# EAGLE design Battery Discharge Monitoring Board rev3 (EAGLE 9.4.2)
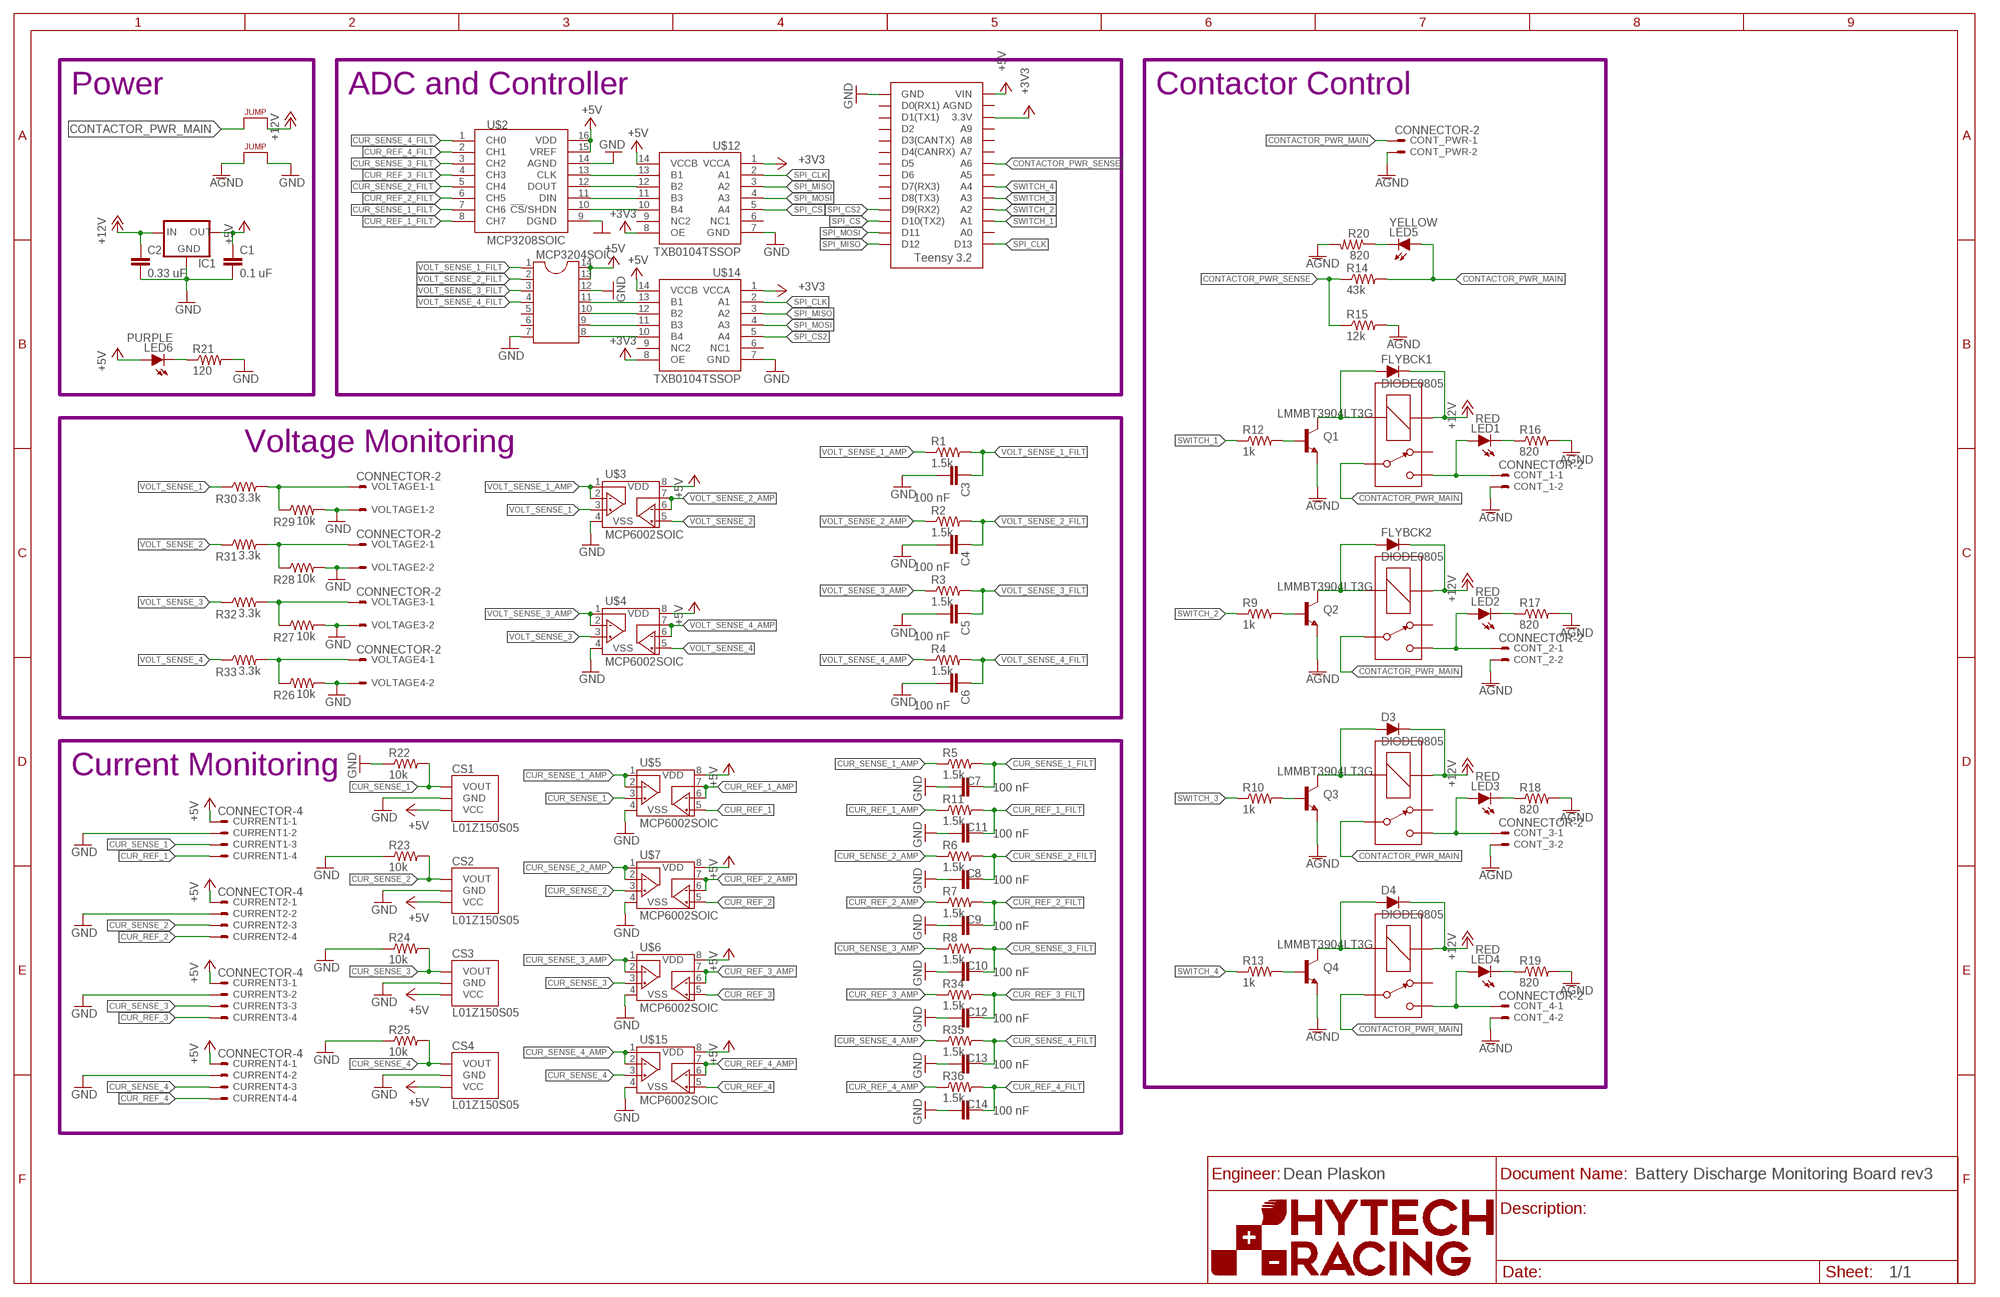
[diagram p0: schematic, sheet 1]
U$13 (FRAME_B_L): ORIENTATION: LANDSCAPE; SIZE: B

## Parts
C1  0.1 uF  CAP0805  [0805]
C2  0.33 uF  CAP0805  [0805]
C3  100 nF  CAP0805  [0805]
C4  100 nF  CAP0805  [0805]
C5  100 nF  CAP0805  [0805]
C6  100 nF  CAP0805  [0805]
C7  100 nF  CAP0805  [0805]
C8  100 nF  CAP0805  [0805]
C9  100 nF  CAP0805  [0805]
C10  100 nF  CAP0805  [0805]
C11  100 nF  CAP0805  [0805]
C12  100 nF  CAP0805  [0805]
C13  100 nF  CAP0805  [0805]
C14  100 nF  CAP0805  [0805]
CONT_1  CONNECTOR-2  [MINIFIT_5566-2]
CONT_2  CONNECTOR-2  [MINIFIT_5566-2]
CONT_3  CONNECTOR-2  [MINIFIT_5566-2]
CONT_4  CONNECTOR-2  [MINIFIT_5566-2]
CONT_PWR  CONNECTOR-2  [MINIFIT_5566-2]
CS1  L01Z150S05  [L01Z150S05]
CS2  L01Z150S05  [L01Z150S05]
CS3  L01Z150S05  [L01Z150S05]
CS4  L01Z150S05  [L01Z150S05]
CURRENT1  CONNECTOR-4  [MINIFIT_5566-4]
CURRENT2  CONNECTOR-4  [MINIFIT_5566-4]
CURRENT3  CONNECTOR-4  [MINIFIT_5566-4]
CURRENT4  CONNECTOR-4  [MINIFIT_5566-4]
D3  DIODE0805  [0805_D]
D4  DIODE0805  [0805_D]
FLYBCK1  DIODE0805  [0805_D]
FLYBCK2  DIODE0805  [0805_D]
IC1  5VREG_L7805SPACED  [TO-220-SPACED]
J1  JUMPER.1  [1X02]
J2  JUMPER  [0805]
LED1  RED  LED-0805  [LED-805]
LED2  RED  LED-0805  [LED-805]
LED3  RED  LED-0805  [LED-805]
LED4  RED  LED-0805  [LED-805]
LED5  YELLOW  LED-0805  [LED-805]
LED6  PURPLE  LED-0805  [LED-805]
MCP3204SOIC  MCP3204SOIC  [SOIC-14]
Q1  LMMBT3904LT3G  BJT_NPNSOT  [SOT23]
Q2  LMMBT3904LT3G  BJT_NPNSOT  [SOT23]
Q3  LMMBT3904LT3G  BJT_NPNSOT  [SOT23]
Q4  LMMBT3904LT3G  BJT_NPNSOT  [SOT23]
R1  1.5k  RESISTOR0805-RES  [0805]
R2  1.5k  RESISTOR0805-RES  [0805]
R3  1.5k  RESISTOR0805-RES  [0805]
R4  1.5k  RESISTOR0805-RES  [0805]
R5  1.5k  RESISTOR0805-RES  [0805]
R6  1.5k  RESISTOR0805-RES  [0805]
R7  1.5k  RESISTOR0805-RES  [0805]
R8  1.5k  RESISTOR0805-RES  [0805]
R9  1k  RESISTOR0805-RES  [0805]
R10  1k  RESISTOR0805-RES  [0805]
R11  1.5k  RESISTOR0805-RES  [0805]
R12  1k  RESISTOR0805-RES  [0805]
R13  1k  RESISTOR0805-RES  [0805]
R14  43k  RESISTOR0805-RES  [0805]
R15  12k  RESISTOR0805-RES  [0805]
R16  820  RESISTOR0805-RES  [0805]
R17  820  RESISTOR0805-RES  [0805]
R18  820  RESISTOR0805-RES  [0805]
R19  820  RESISTOR0805-RES  [0805]
R20  820  RESISTOR0805-RES  [0805]
R21  120  RESISTOR0805-RES  [0805]
R22  10k  RESISTOR0805-RES  [0805]
R23  10k  RESISTOR0805-RES  [0805]
R24  10k  RESISTOR0805-RES  [0805]
R25  10k  RESISTOR0805-RES  [0805]
R26  10k  RESISTOR0805-RES  [0805]
R27  10k  RESISTOR0805-RES  [0805]
R28  10k  RESISTOR0805-RES  [0805]
R29  10k  RESISTOR0805-RES  [0805]
R30  3.3k  RESISTOR0805-RES  [0805]
R31  3.3k  RESISTOR0805-RES  [0805]
R32  3.3k  RESISTOR0805-RES  [0805]
R33  3.3k  RESISTOR0805-RES  [0805]
R34  1.5k  RESISTOR0805-RES  [0805]
R35  1.5k  RESISTOR0805-RES  [0805]
R36  1.5k  RESISTOR0805-RES  [0805]
U$1  TEENSY_3.2_SIMPLE  [TEENSY_3.2_SIMPLE]
U$2  MCP3208SOIC  [SOIC-16]
U$3  MCP6002SOIC  [SOIC-08]
U$4  MCP6002SOIC  [SOIC-08]
U$5  MCP6002SOIC  [SOIC-08]
U$6  MCP6002SOIC  [SOIC-08]
U$7  MCP6002SOIC  [SOIC-08]
U$8  G5LE  [ZF112]
U$9  G5LE  [ZF112]
U$10  G5LE  [ZF112]
U$11  G5LE  [ZF112]
U$12  TXB0104TSSOP  [TSSOP-14]
U$14  TXB0104TSSOP  [TSSOP-14]
U$15  MCP6002SOIC  [SOIC-08]
VOLTAGE1  CONNECTOR-2  [MINIFIT_5566-2]
VOLTAGE2  CONNECTOR-2  [MINIFIT_5566-2]
VOLTAGE3  CONNECTOR-2  [MINIFIT_5566-2]
VOLTAGE4  CONNECTOR-2  [MINIFIT_5566-2]

## Nets
+3V3: U$1.3.3V U$12.1(VCCA) U$12.8(OE) U$14.1(VCCA) U$14.8(OE)
+5V: C1.1 CS1.3(VCC) CS2.3(VCC) CS3.3(VCC) CS4.3(VCC) CURRENT1.1 CURRENT2.1 CURRENT3.1 CURRENT4.1 IC1.3(OUT) LED6.A MCP3204SOIC.13(VREF) MCP3204SOIC.14(VDD) U$1.VIN U$2.15(VREF) U$2.16(VDD) U$3.8(VDD) U$4.8(VDD) U$5.8(VDD) U$6.8(VDD) U$7.8(VDD) U$12.14(VCCB) U$14.14(VCCB) U$15.8(VDD)
+12V: C2.1 D3.C D4.C FLYBCK1.C FLYBCK2.C IC1.1(IN) J1.2 U$8.1(COIL+) U$9.1(COIL+) U$10.1(COIL+) U$11.1(COIL+)
AGND: CONT_1.2 CONT_2.2 CONT_3.2 CONT_4.2 CONT_PWR.2 J2.1 Q1.2(EMITTER) Q2.2(EMITTER) Q3.2(EMITTER) Q4.2(EMITTER) R15.2 R16.2 R17.2 R18.2 R19.2 R20.2
CONTACTOR_PWR_1: CONT_1.1 LED1.A U$8.S
CONTACTOR_PWR_2: CONT_2.1 LED2.A U$9.S
CONTACTOR_PWR_3: CONT_3.1 LED3.A U$10.S
CONTACTOR_PWR_4: CONT_4.1 LED4.A U$11.S
CONTACTOR_PWR_MAIN: CONT_PWR.1 J1.1 LED5.A R14.2 U$8.P U$9.P U$10.P U$11.P
CONTACTOR_PWR_SENSE: R14.1 R15.1 U$1.A6
CUR_REF_1: CURRENT1.4 U$5.5(VINB+)
CUR_REF_1_AMP: R11.1 U$5.6(VINB-) U$5.7(VOUTB)
CUR_REF_1_FILT: C11.1 R11.2 U$2.8(CH7)
CUR_REF_2: CURRENT2.4 U$7.5(VINB+)
CUR_REF_2_AMP: R7.1 U$7.6(VINB-) U$7.7(VOUTB)
CUR_REF_2_FILT: C9.1 R7.2 U$2.6(CH5)
CUR_REF_3: CURRENT3.4 U$6.5(VINB+)
CUR_REF_3_AMP: R34.1 U$6.6(VINB-) U$6.7(VOUTB)
CUR_REF_3_FILT: C12.1 R34.2 U$2.4(CH3)
CUR_REF_4: CURRENT4.4 U$15.5(VINB+)
CUR_REF_4_AMP: R36.1 U$15.6(VINB-) U$15.7(VOUTB)
CUR_REF_4_FILT: C14.1 R36.2 U$2.2(CH1)
CUR_SENSE_1: CS1.1(VOUT) CURRENT1.3 R22.2 U$5.3(VINA+)
CUR_SENSE_1_AMP: R5.1 U$5.1(VOUTA) U$5.2(VINA-)
CUR_SENSE_1_FILT: C7.1 R5.2 U$2.7(CH6)
CUR_SENSE_2: CS2.1(VOUT) CURRENT2.3 R23.2 U$7.3(VINA+)
CUR_SENSE_2_AMP: R6.1 U$7.1(VOUTA) U$7.2(VINA-)
CUR_SENSE_2_FILT: C8.1 R6.2 U$2.5(CH4)
CUR_SENSE_3: CS3.1(VOUT) CURRENT3.3 R24.2 U$6.3(VINA+)
CUR_SENSE_3_AMP: R8.1 U$6.1(VOUTA) U$6.2(VINA-)
CUR_SENSE_3_FILT: C10.1 R8.2 U$2.3(CH2)
CUR_SENSE_4: CS4.1(VOUT) CURRENT4.3 R25.2 U$15.3(VINA+)
CUR_SENSE_4_AMP: R35.1 U$15.1(VOUTA) U$15.2(VINA-)
CUR_SENSE_4_FILT: C13.1 R35.2 U$2.1(CH0)
GND: C1.2 C2.2 C3.2 C4.2 C5.2 C6.2 C7.2 C8.2 C9.2 C10.2 C11.2 C12.2 C13.2 C14.2 CS1.2(GND) CS2.2(GND) CS3.2(GND) CS4.2(GND) CURRENT1.2 CURRENT2.2 CURRENT3.2 CURRENT4.2 IC1.2(GND) J2.2 MCP3204SOIC.7(DGND) MCP3204SOIC.12(AGND) R21.2 R22.1 R23.1 R24.1 R25.1 R26.2 R27.2 R28.2 R29.2 U$1.GND U$2.9(DGND) U$2.14(AGND) U$3.4(VSS) U$4.4(VSS) U$5.4(VSS) U$6.4(VSS) U$7.4(VSS) U$12.7(GND) U$14.7(GND) U$15.4(VSS) VOLTAGE1.2 VOLTAGE2.2 VOLTAGE3.2 VOLTAGE4.2
N27: R26.1 R33.2 VOLTAGE4.1
N$1: MCP3204SOIC.11(CLK) U$14.13(B1)
N$2: MCP3204SOIC.10(DOUT) U$14.12(B2)
N$3: Q2.1(BASE) R9.2
N$4: Q1.1(BASE) R12.2
N$5: FLYBCK1.A Q1.3(COLLECTOR) U$8.2(COIL-)
N$6: FLYBCK2.A Q2.3(COLLECTOR) U$9.2(COIL-)
N$7: Q3.1(BASE) R10.2
N$8: D3.A Q3.3(COLLECTOR) U$10.2(COIL-)
N$9: Q4.1(BASE) R13.2
N$10: D4.A Q4.3(COLLECTOR) U$11.2(COIL-)
N$11: LED2.C R17.1
N$12: LED1.C R16.1
N$13: LED3.C R18.1
N$14: LED4.C R19.1
N$15: LED5.C R20.1
N$16: LED6.C R21.1
N$17: U$2.13(CLK) U$12.13(B1)
N$18: U$2.12(DOUT) U$12.12(B2)
N$19: U$2.11(DIN) U$12.11(B3)
N$20: U$2.10(!CS!/SHDN) U$12.10(B4)
N$22: R29.1 R30.2 VOLTAGE1.1
N$23: R28.1 R31.2 VOLTAGE2.1
N$24: R27.1 R32.2 VOLTAGE3.1
N$25: MCP3204SOIC.9(DIN) U$14.11(B3)
N$26: MCP3204SOIC.8(/CS) U$14.10(B4)
SPI_CLK: U$1.D13 U$12.2(A1) U$14.2(A1)
SPI_CS: U$1.D10(TX2) U$12.5(A4)
SPI_CS2: U$1.D9(RX2) U$14.5(A4)
SPI_MISO: U$1.D12 U$12.3(A2) U$14.3(A2)
SPI_MOSI: U$1.D11 U$12.4(A3) U$14.4(A3)
SWITCH_1: R12.1 U$1.A1
SWITCH_2: R9.1 U$1.A2
SWITCH_3: R10.1 U$1.A3
SWITCH_4: R13.1 U$1.A4
VOLT_SENSE_1: R30.1 U$3.3(VINA+)
VOLT_SENSE_1_AMP: R1.1 U$3.1(VOUTA) U$3.2(VINA-)
VOLT_SENSE_1_FILT: C3.1 MCP3204SOIC.1(CH0) R1.2
VOLT_SENSE_2: R31.1 U$3.5(VINB+)
VOLT_SENSE_2_AMP: R2.1 U$3.6(VINB-) U$3.7(VOUTB)
VOLT_SENSE_2_FILT: C4.1 MCP3204SOIC.2(CH1) R2.2
VOLT_SENSE_3: R32.1 U$4.3(VINA+)
VOLT_SENSE_3_AMP: R3.1 U$4.1(VOUTA) U$4.2(VINA-)
VOLT_SENSE_3_FILT: C5.1 MCP3204SOIC.3(CH2) R3.2
VOLT_SENSE_4: R33.1 U$4.5(VINB+)
VOLT_SENSE_4_AMP: R4.1 U$4.6(VINB-) U$4.7(VOUTB)
VOLT_SENSE_4_FILT: C6.1 MCP3204SOIC.4(CH3) R4.2
Unconnected: MCP3204SOIC.5(NC0) MCP3204SOIC.6(NC1) U$1.A0 U$1.A5 U$1.A7 U$1.A8 U$1.A9 U$1.AGND U$1.D0(RX1) U$1.D1(TX1) U$1.D2 U$1.D3(CANTX) U$1.D4(CANRX) U$1.D5 U$1.D6 U$1.D7(RX3) U$1.D8(TX3) U$8.O U$9.O U$10.O U$11.O U$12.6(NC1) U$12.9(NC2) U$14.6(NC1) U$14.9(NC2)

## Notes on the sheet
- Power | ADC and Controller | Contactor Control
- Voltage Monitoring
- Current Monitoring
- Dean Plaskon

## Library data of the parts
C1-C14 = HyTechDevices:CAP: Capacitor Standard 0603 ceramic capacitor, and 0.1" leaded capacitor.
CONT_1-CONT_4 CONT_PWR VOLTAGE1-VOLTAGE4 = HyTechDevices:CONNECTOR-2: Mini-Fit Junior connector 2 pole Source: http://www.molex.com; OC_FARNELL: 1822072; OC_NEWARK: unknown
CS1-CS4 = HyTechDevices:L01Z150S05: Tamura Hall Effect Current Sensors L01Z***S05 Series Refer to datasheet <http://www.tamuracorp.com/clientuploads/pdfs/engineeringdocs/L01ZXXXS05.pdf>
CURRENT1-CURRENT4 = HyTechDevices:CONNECTOR-4: Mini-Fit Junior connector 4 pole Source: http://www.molex.com; OC_FARNELL: unknown; OC_NEWARK: unknown
D3 D4 FLYBCK1 FLYBCK2 = HyTechDevices:DIODE: DIODE general purpose rectifier
IC1 = HyTechDevices:5VREG_L7805: Voltage Regulator Switching 5v regulator Datasheet <http://power.murata.com/data/power/oki-78sr.pdf> Standard 7805 5V regulator. IGO (Input Ground Output). Spark Fun Electronics SKU : COM-00107 Datasheet <http://www.mouser.com/ds/2/308/MC7800-D-94905.pdf>
J1 J2 = HyTechDevices:JUMPER: Jumper for changing operation of a device
LED1-LED6 = HyTechDevices:LED: Light Emitting Diode (LED) Source: Dangerous Prototypes Eagle Library <https://github.com/DangerousPrototypes/Eagle_Part_Library>
MCP3204SOIC = MCP3204SOIC:MCP3204SOIC: 4 Channel 12-Bit ADC
Q1-Q4 = HyTechDevices:BJT_NPN: Generic NPN BJT MMBT2222A - TRANS-08049 (SOT-23, 1A 40V) MPSA42 - TRANS-09116 (SOT-23, 500mA 300V) MMBT5088LT1G - TRANS-11160 (SOT-23, 50 mA 30V) BC547 - COM-08928 <http://www.sparkfun.com/products/8928> (TO-92 45V 100mA) (1.Collector 2.Base 3.Emitter) 2N3904 - COM-00521 <http://www.sparkfun.com/products/521> (TO-92 40V 200mA) (1.Emitter 2.Base 3.Collector) P2N2222A - COM-12852 <http://www.sparkfun.com/products/12852> (TO-92 40V 600mA) (1.Collector 2.Base 3.Emitter) Source: Sparkfun <https://github.com/sparkfun/SparkFun-Eagle-Libraries>
R1-R36 = HyTechDevices:RESISTOR: Resistor Basic schematic elements and footprints for 0603, 1206, and PTH resistors.
U$1 = HyTechDevices:TEENSY_3.2_SIMPLE: Simple version of the Teensy 3.2 board that only uses the 2 main rows of pins, not the inner pins or the pins opposite the usb port.
U$2 = HyTechDevices:MCP3208: Analog to Digital Converter
U$3-U$7 U$15 = HyTechDevices:MCP6002: Microchip MCP6002 Dual Channel Op Amp
U$8-U$11 = HyTechDevices:G5LE: Omron G5LE SPST Relay 5 VDC, 12VDC, 24VDC models Coil voltage: 75% - 170% of nominal voltage Datasheet <https://www.omron.com/ecb/products/pdf/en-g5le.pdf>
U$12 U$14 = HyTechDevices:TXB0104: Texas Instruments TXB0104 4-channel low voltage to high voltage Logic Level Shifter. Minimum input voltage level 1.8V. Maximum output voltage level 5.5V.

## Board
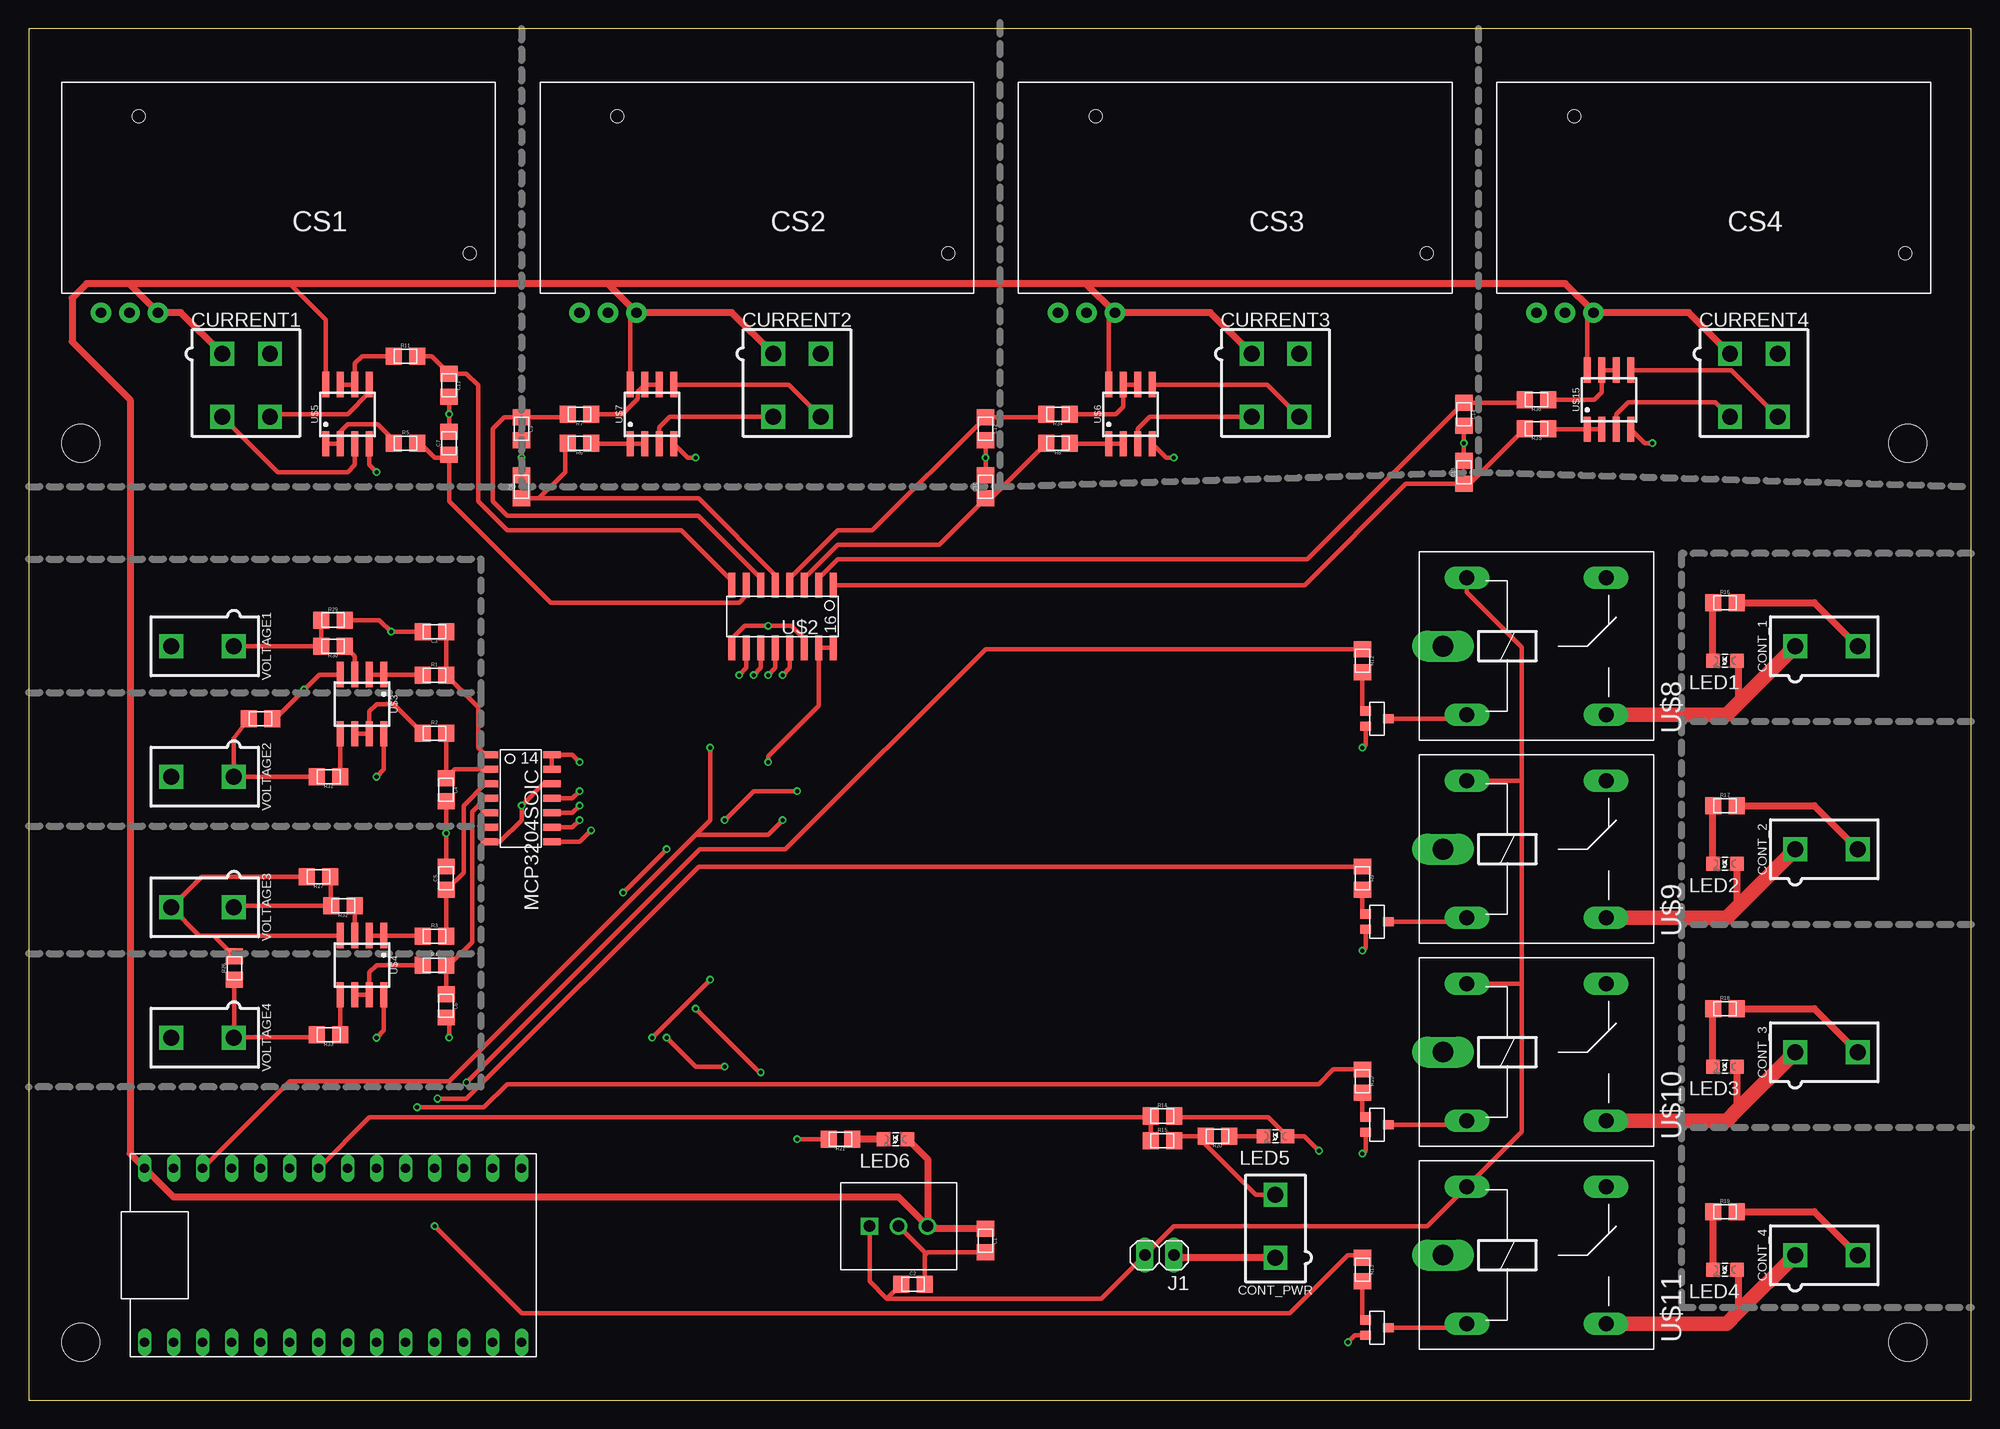
[diagram p1: board, top side]
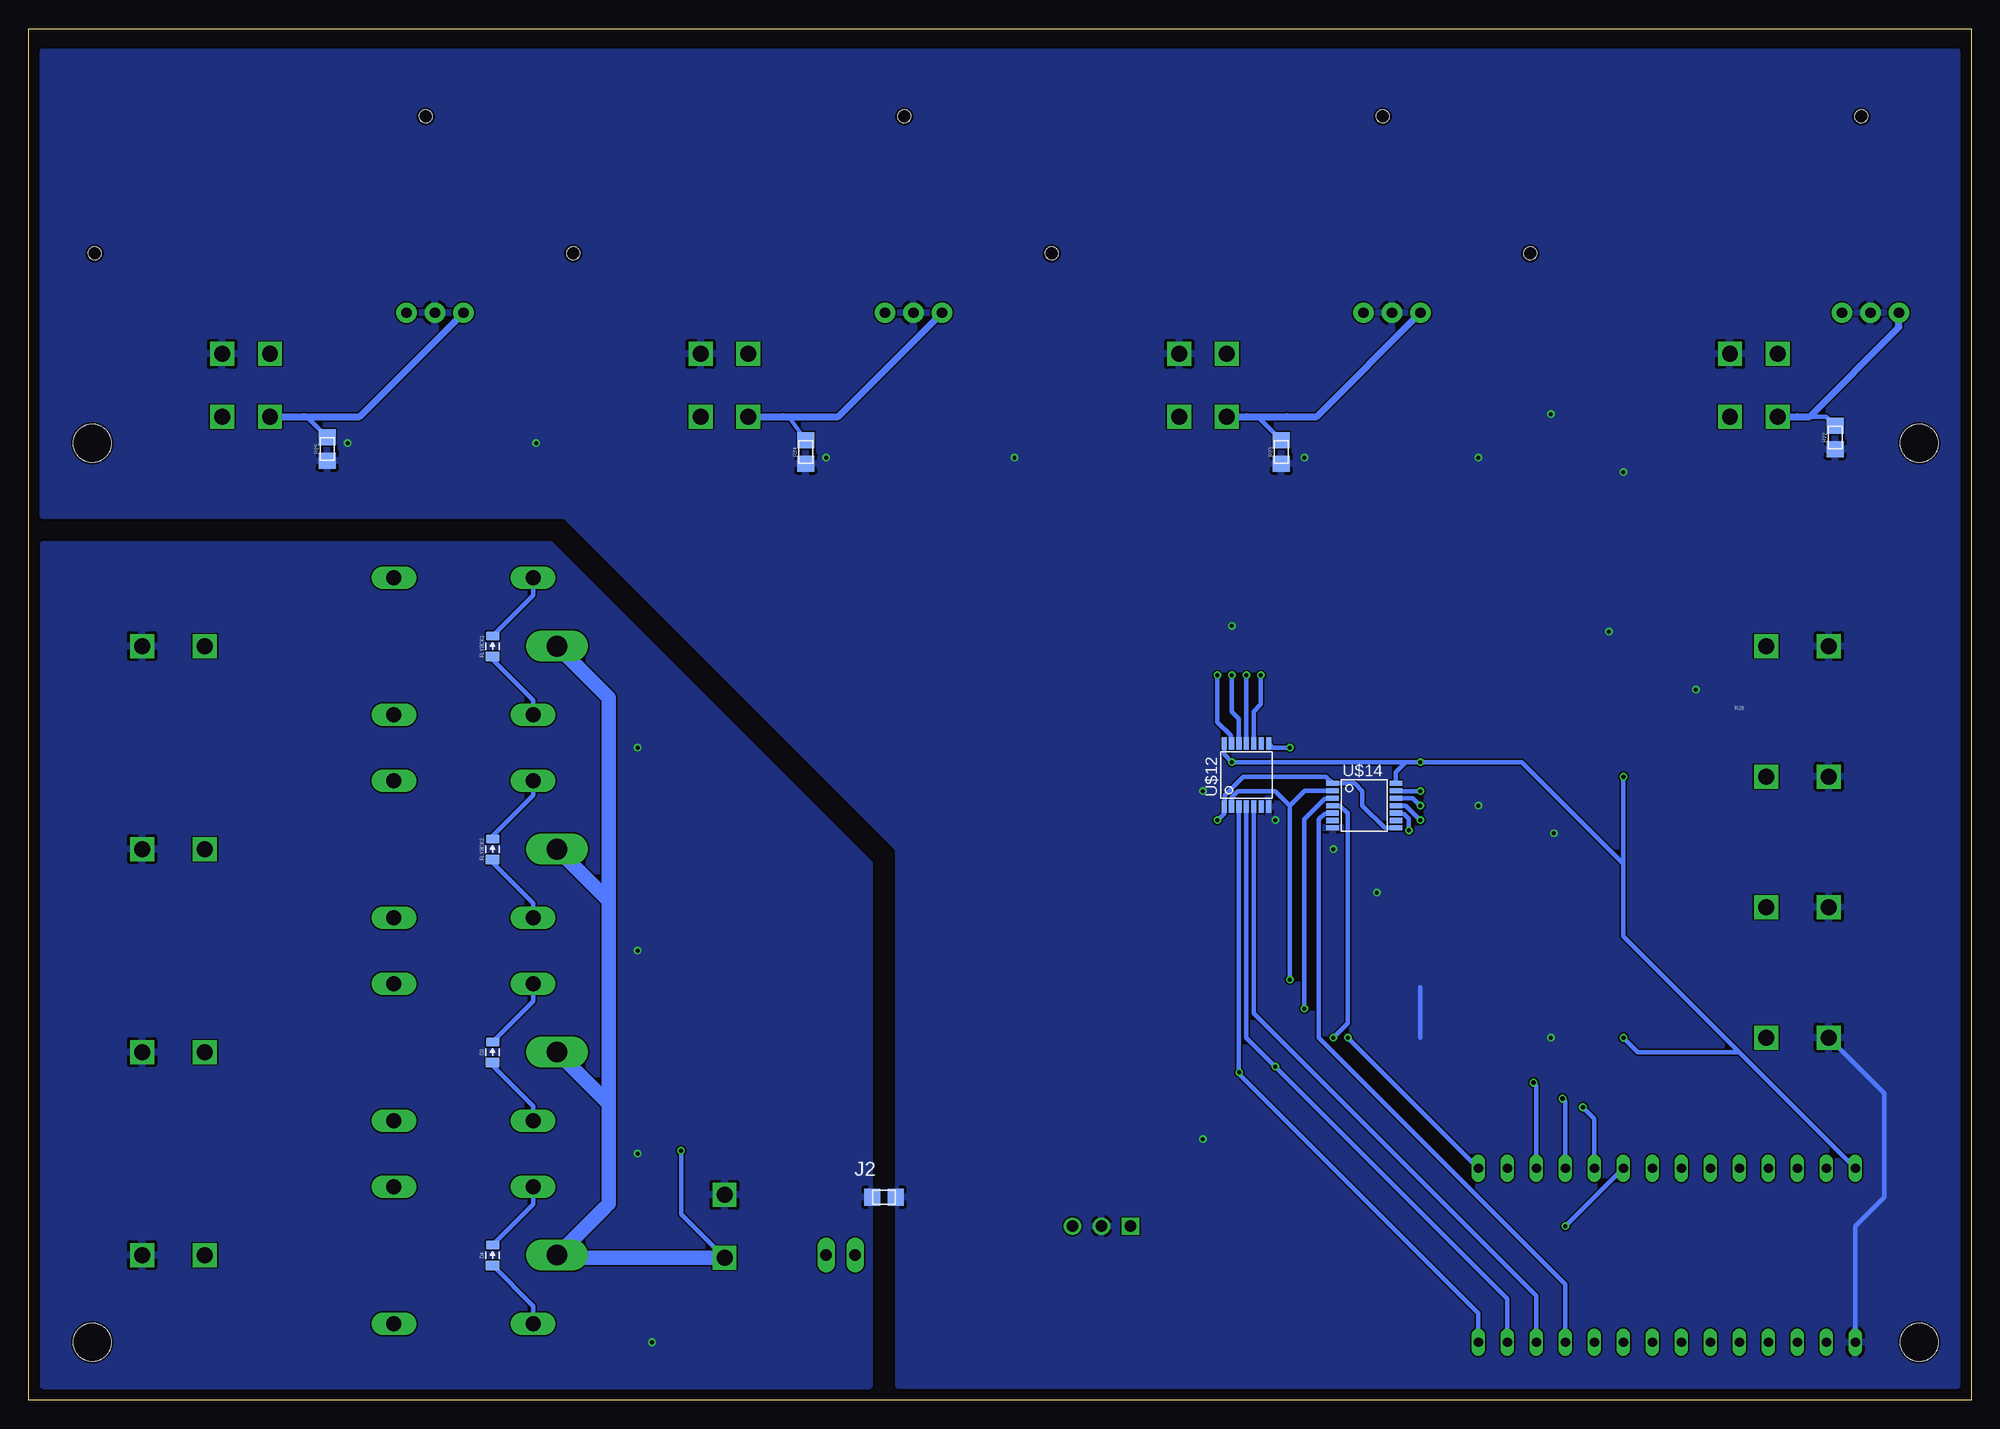
[diagram p2: board, bottom side, seen from below]

Size 170.18 x 120.14 mm. Coordinates in mm from the lower left corner, seen from the top.
Outline: 0,0 170.18,0 170.18,120.14 0,120.14 0,0
Copper layers (1*16): Top 0.035mm / dielectric 1.53mm / Bottom 0.035mm
Design rules "JLCPCB (2 Layer)": minimum track width 5mil, minimum drill 0.3mm, track to track 5mil, track to pad 5mil, pad to pad 5mil, via to via 20mil, smd to smd 5mil, copper to edge 0.2mm, drill to drill 21mil, minimum pad ring 6mil, minimum via ring 6mil, stop-mask expansion 6mil, vias tented up to drill 30mil, thermal gap 10mil
Holes 3.3 mm at 4.57,5.08 164.59,5.08 4.57,83.82 164.59,83.82

### Footprints (pad centres in the part's own frame; a part is rotated, then mirrored left to right if it is on the bottom)
0805 = smd 1.4 x 1.5: 1 -1.025,0; 2 1.025,0
MINIFIT_5566-2 = drill 1.4 square: 1 0,-2.75; 2 0,2.75
L01Z150S05 = drill 0.9 pad 1.778: 1 0,0; 2 -2.5,0; 3 -5,0 | hole 1.15: -3.3,-17.2; -32.3,-5.2
MINIFIT_5566-4 = drill 1.4 square: 1 2.1,-2.75; 2 -2.1,-2.75; 3 2.1,2.75; 4 -2.1,2.75
0805_D = smd 0.8 x 1.2: A -0.9,0; C 0.9,0
TO-220-SPACED = drill 1 square: 1 -2.54,0 | drill 1: 2 0,0; 3 2.54,0
1X02 = drill 1.016 long: 1 -1.27,0; 2 1.27,0
LED-805 = smd 1.2 x 1.2: A 0,-1.05; C 0,1.05
SOIC-14 = smd 0.61 x 1.524: 1 -4.445,-2.794; 2 -3.175,-2.794; 3 -1.905,-2.794; 4 -0.635,-2.794; 5 0.635,-2.794; 6 1.905,-2.794; 7 3.175,-2.794; 8 3.175,2.667; 9 1.905,2.667; 10 0.635,2.667; 11 -0.635,2.667; 12 -1.905,2.667; 13 -3.175,2.667; 14 -4.445,2.667
SOT23 = smd 0.8 x 0.9: 1 -0.675,-1; 2 0.675,-1; 3 0,1
TEENSY_3.2_SIMPLE = drill 0.8 long: 3.3V 16.51,29.21; A0 16.51,3.81; A1 16.51,6.35; A2 16.51,8.89; A3 16.51,11.43; A4 16.51,13.97; A5 16.51,16.51; A6 16.51,19.05; A7 16.51,21.59; A8 16.51,24.13; A9 16.51,26.67; AGND 16.51,31.75; D0(RX1) 1.27,31.75; D1(TX1) 1.27,29.21; D2 1.27,26.67; D3(CANTX) 1.27,24.13; D4(CANRX) 1.27,21.59; D5 1.27,19.05; D6 1.27,16.51; D7(RX3) 1.27,13.97; D8(TX3) 1.27,11.43; D9(RX2) 1.27,8.89; D10(TX2) 1.27,6.35; D11 1.27,3.81; D12 1.27,1.27; D13 16.51,1.27; GND 1.27,34.29; VIN 16.51,34.29
SOIC-16 = smd 0.6 x 2.2: 1 -4.445,-2.794; 2 -3.175,-2.794; 3 -1.905,-2.794; 4 -0.635,-2.794; 5 0.635,-2.794; 6 1.905,-2.794; 7 3.175,-2.794; 8 4.445,-2.794; 9 4.445,2.667; 10 3.175,2.667; 11 1.905,2.667; 12 0.635,2.667; 13 -0.635,2.667; 14 -1.905,2.667; 15 -3.175,2.667; 16 -4.445,2.667
SOIC-08 = smd 0.6 x 2.2: 1 -1.905,-2.6; 2 -0.635,-2.6; 3 0.635,-2.6; 4 1.905,-2.6; 5 1.905,2.6; 6 0.635,2.6; 7 -0.635,2.6; 8 -1.905,2.6
ZF112 = drill 1.321 long: 1 4.064,14.884; 2 4.064,2.896; O 16.256,14.884; S 16.256,2.896 | drill 1.803 long: P 1.956,8.89
TSSOP-14 = smd 0.45 x 1.1: 1 -1.958,-2.618; 2 -1.308,-2.618; 3 -0.657,-2.618; 4 -0.007,-2.618; 5 0.642,-2.618; 6 1.292,-2.618; 7 1.942,-2.618; 8 1.942,2.918; 9 1.292,2.918; 10 0.642,2.918; 11 -0.007,2.918; 12 -0.657,2.918; 13 -1.308,2.918; 14 -1.958,2.918

### Placement (x,y rotation side)
C1  83.82,13.97 270 top
C2  77.47,10.16 0 top
C3  35.56,67.31 180 top
C4  36.58,53.47 270 top
C5  36.58,45.72 90 top
C6  36.58,34.54 270 top
C7  36.83,83.82 90 top
C8  43.18,80.01 90 top
C9  43.18,85.09 270 top
C10  83.82,80.01 90 top
C11  36.83,88.9 270 top
C12  83.82,85.09 270 top
C13  125.73,81.28 90 top
C14  125.73,86.36 270 top
CONT_1  157.48,66.04 270 top
CONT_2  157.48,48.26 270 top
CONT_3  157.48,30.48 270 top
CONT_4  157.48,12.7 270 top
CONT_PWR  109.22,15.24 0 top
CS1  6.35,95.25 180 top
CS2  48.26,95.25 180 top
CS3  90.17,95.25 180 top
CS4  132.08,95.25 180 top
CURRENT1  19.05,88.9 180 top
CURRENT2  67.31,88.9 180 top
CURRENT3  109.22,88.9 180 top
CURRENT4  151.13,88.9 180 top
D3  129.54,30.48 90 bottom
D4  129.54,12.7 90 bottom
FLYBCK1  129.54,66.04 90 bottom
FLYBCK2  129.54,48.26 90 bottom
IC1  76.2,15.24 0 top
J1  99.06,12.7 180 top
J2  95.25,17.78 0 bottom
LED1  148.59,64.77 90 top
LED2  148.59,46.99 90 top
LED3  148.59,29.21 90 top
LED4  148.59,11.43 90 top
LED5  109.22,23.11 90 top
LED6  75.95,22.86 90 top
MCP3204SOIC  43.18,52.07 270 top
Q1  118.11,59.69 270 top
Q2  118.11,41.91 270 top
Q3  118.11,24.13 270 top
Q4  118.11,6.35 270 top
R1  35.56,63.5 0 top
R2  35.56,58.42 0 top
R3  35.56,40.64 0 top
R4  35.56,38.1 0 top
R5  33.02,83.82 0 top
R6  48.26,83.82 180 top
R7  48.26,86.36 180 top
R8  90.17,83.82 180 top
R9  116.84,45.72 270 top
R10  116.84,27.94 270 top
R11  33.02,91.44 0 top
R12  116.84,64.77 270 top
R13  116.84,11.43 270 top
R14  99.31,24.89 0 top
R15  99.31,22.73 0 top
R16  148.59,69.85 0 top
R17  148.59,52.07 0 top
R18  148.59,34.29 0 top
R19  148.59,16.51 0 top
R20  104.14,23.11 180 top
R21  71.12,22.86 180 top
R22  11.94,84.33 90 bottom
R23  60.45,83.06 90 bottom
R24  102.11,83.06 90 bottom
R25  144.02,83.31 90 bottom
R26  18.03,37.85 90 top
R27  25.4,45.85 180 top
R28  20.32,59.69 0 top
R29  26.67,68.33 0 top
R30  26.67,66.04 180 top
R31  26.29,54.61 180 top
R32  27.56,43.31 180 top
R33  26.29,32 180 top
R34  90.17,86.36 180 top
R35  132.08,85.09 180 top
R36  132.08,87.63 180 top
U$1  44.45,3.81 90 top
U$2  66.04,68.58 180 top
U$3  29.21,60.96 180 top
U$4  29.21,38.1 180 top
U$5  27.94,86.36 0 top
U$6  96.52,86.36 0 top
U$7  54.61,86.36 0 top
U$8  121.92,57.15 0 top
U$9  121.92,39.37 0 top
U$10  121.92,21.59 0 top
U$11  121.92,3.81 0 top
U$12  63.5,54.61 0 bottom
U$14  53.34,52.07 270 bottom
U$15  138.43,87.63 0 top
VOLTAGE1  15.24,66.04 90 top
VOLTAGE2  15.24,54.61 90 top
VOLTAGE3  15.24,43.18 90 top
VOLTAGE4  15.24,31.75 90 top

### Tracks (layer width: path | path; a pad name or v marks a point on that pad's centre or on a via)
+3V3  (via drill 0.35)
  Top 0.406: U$1.3.3V 22.86,27.94 36.83,27.94 58.42,49.53 | v66.04,50.8 64.77,49.53 58.42,49.53 | v59.69,57.15 59.69,53.34 59.69,50.8 58.42,49.53
  Bottom 0.406: U$12.8 61.18,57.15 v59.69,57.15 | v66.04,50.8 65.46,51.38 U$12.1 65.39,52.06 65.39,53 63.78,54.61 56.54,54.61 U$14.1 54.03,54.03 53.34,53.34 53.34,52.07 51.4,50.13 U$14.8
+5V  (via drill 0.35, 0.38)
  Top 0.406: U$3.8 31.11,55.24 v30.48,54.61 | U$4.8 31.11,32.38 v30.48,31.75 | U$15.8 136.53,94.69 CS4.3 | U$6.8 94.61,94.69 CS3.3 | U$7.8 52.7,94.69 CS2.3 | U$5.8 26.04,94.61 22.86,97.79 | v64.77,55.88 64.77,56.39 69.22,60.83 U$2.15 U$2.16 | MCP3204SOIC.13 MCP3204SOIC.14 47.62,56.52 v48.26,55.88
  Top 0.61: CURRENT1.1 13.35,95.25 CS1.3 8.81,97.79 | CURRENT2.1 61.61,95.25 CS2.3 50.72,97.79 | CURRENT3.1 103.52,95.25 CS3.3 92.71,97.71 92.71,97.79 | CURRENT4.1 145.43,95.25 CS4.3 137.08,95.33 134.62,97.79 92.71,97.79 | 92.71,97.79 83.82,97.79 50.72,97.79 | 50.72,97.79 41.91,97.79 22.86,97.79 8.81,97.79 | 8.81,97.79 5.08,97.79 3.81,96.52 3.81,92.71 8.89,87.63 8.89,21.59 U$1.VIN 12.7,17.78 76.2,17.78 IC1.3 | LED6.A 78.74,21.12 IC1.3 | C1.1 78.98,14.99 IC1.3
  Bottom 0.406: U$1.VIN 20.32,30.48 | 20.32,30.48 30.48,40.64 30.48,46.99 | v30.48,31.75 29.21,30.48 20.32,30.48 | 30.48,46.99 v30.48,54.61 | 30.48,46.99 39.37,55.88 v48.26,55.88 49.53,55.88 | 49.53,55.88 v64.77,55.88 65.46,56.57 U$12.14 | U$14.14 50.42,54.99 49.53,55.88
+12V
  Top 0.406: 130.81,54.25 130.81,65.94 125.98,70.76 U$8.1 | U$9.1 130.81,54.25 | 130.81,54.25 130.81,36.47 | U$10.1 130.81,36.47 | 130.81,36.47 130.81,23.52 U$11.1 122.53,15.24 100.33,15.24 J1.2 93.98,8.89 75.17,8.89 | C2.1 75.17,8.89 | 75.17,8.89 73.66,10.4 IC1.1
  Bottom 0.406: FLYBCK1.C 125.98,70.5 U$8.1 | U$9.1 125.98,52.98 129.54,49.43 FLYBCK2.C | D3.C 125.98,34.94 U$10.1 | D4.C 125.98,17.16 U$11.1
AGND  (via drill 0.35, 0.38)
  Top 0.406: Q1.2 117.11,57.42 v116.84,57.15 | Q2.2 117.11,39.64 v116.84,39.37 | Q3.2 117.11,21.86 v116.84,21.59 | v115.57,5.08 116.17,5.67 Q4.2 | CONT_PWR.2 107.49,17.99 103.11,22.36 R20.2 100.72,23.11 R15.2
  Top 0.61: R16.2 156.42,69.85 CONT_1.2 | R17.2 156.42,52.07 CONT_2.2 | R18.2 156.42,34.29 CONT_3.2 | R19.2 156.42,16.51 CONT_4.2
  pour Bottom: 96.52,1.27 96.52,46.99 124.46,74.93 168.91,74.93 168.91,1.27
CONTACTOR_PWR_1
  Top 0.61: LED1.A 149.75,64.66 149.75,61.06
  Top 1.27: U$8.S 148.74,60.05 149.75,61.06 CONT_1.1
CONTACTOR_PWR_2
  Top 0.61: LED2.A 149.64,43.4 149.75,43.28
  Top 1.27: U$9.S 148.74,42.27 149.75,43.28 CONT_2.1
CONTACTOR_PWR_3
  Top 0.61: LED3.A 149.64,25.62 149.75,25.5
  Top 1.27: U$10.S 148.74,24.49 149.75,25.5 CONT_3.1
CONTACTOR_PWR_4
  Top 0.61: LED4.A 149.75,11.31 149.75,7.72
  Top 1.27: U$11.S 148.74,6.71 149.75,7.72 CONT_4.1
CONTACTOR_PWR_MAIN  (via drill 0.38)
  Top 0.406: v113.03,21.84 111.76,23.11 LED5.A 108.6,24.78 100.45,24.78 R14.2
  Top 0.61: CONT_PWR.1 100.54,12.49 J1.1
  Bottom 0.406: v113.03,21.84 113.03,16.3 CONT_PWR.1
  Bottom 1.016: 119.72,16.85 119.38,17.2
  Bottom 1.27: CONT_PWR.1 123.67,12.49 U$11.P 119.72,16.85 | U$8.P 119.38,61.54 119.38,43.76 | 119.38,17.2 119.38,25.98 | 119.38,25.98 119.38,43.76 | U$9.P 119.38,43.76 | U$10.P 119.38,25.98
CONTACTOR_PWR_SENSE
  Top 0.406: U$1.A6 29.84,24.77 98.16,24.77 R14.1 R15.1
CUR_REF_1
  Top 0.406: CURRENT1.4 21.36,86.36 27.94,86.36 29.84,88.27 U$5.5
CUR_REF_1_AMP
  Top 0.406: U$5.7 U$5.6 28.57,90.81 29.21,91.44 R11.1
CUR_REF_1_FILT
  Top 0.406: R11.2 35.31,91.44 C11.1 38.34,89.92 39.37,88.9 39.37,78.74 41.91,76.2 57.15,76.2 61.59,71.75 U$2.8
CUR_REF_2
  Top 0.406: CURRENT2.4 66.6,88.96 U$7.5
CUR_REF_2_AMP
  Top 0.406: U$7.6 U$7.7 53.36,88.35 53.36,87.71 52.01,86.36 R7.1
CUR_REF_2_FILT
  Top 0.406: R7.2 46.99,86.11 C9.1 41.66,86.11 40.64,85.09 40.64,78.74 41.91,77.47 58.67,77.47 64.14,72.01 U$2.6
CUR_REF_3
  Top 0.406: CURRENT3.4 108.51,88.96 U$6.5
CUR_REF_3_AMP
  Top 0.406: U$6.6 U$6.7 95.89,87 95.25,86.36 R34.1
CUR_REF_3_FILT
  Top 0.406: R34.2 88.9,86.11 C12.1 73.91,76.2 70.87,76.2 66.67,72.01 U$2.4
CUR_REF_4
  Top 0.406: CURRENT4.4 149.15,90.23 U$15.5
CUR_REF_4_AMP
  Top 0.406: U$15.6 U$15.7 137.79,88.27 137.16,87.63 R36.1
CUR_REF_4_FILT
  Top 0.406: R36.2 130.81,87.39 C14.1 112,73.66 70.87,73.66 69.22,72.01 U$2.2
CUR_SENSE_1
  Top 0.406: CURRENT1.3 21.82,81.28 27.94,81.28 28.57,81.92 U$5.3
  Bottom 0.406: R22.2 12.73,86.15 15.24,86.15
  Bottom 0.61: CURRENT1.3 15.24,86.15 14.18,86.15 6.35,93.98 CS1.1
CUR_SENSE_1_AMP
  Top 0.406: U$5.1 U$5.2 27.3,84.84 27.94,85.47 30.61,85.47 32,84.08 R5.1
CUR_SENSE_1_FILT
  Top 0.406: R5.2 34.29,83.82 35.56,82.55 36.59,82.55 C7.1 36.83,78.74 45.72,69.85 62.23,69.85 62.87,70.48 U$2.7
CUR_SENSE_2
  Top 0.406: CURRENT2.3 56.18,86.15 55.24,85.22 U$7.3
  Bottom 0.406: R23.2 62.52,86.15 63.5,86.15
  Bottom 0.61: CURRENT2.3 63.5,86.15 59.94,86.15 57.36,86.15 CS2.1
CUR_SENSE_2_AMP
  Top 0.406: U$7.2 U$7.1 49.34,83.76 R6.1
CUR_SENSE_2_FILT
  Top 0.406: R6.2 46.99,83.58 46.99,81.28 44.7,78.98 C8.1 58.68,78.98 65.53,72.14 65.53,71.5 U$2.5
CUR_SENSE_3
  Top 0.406: CURRENT3.3 98.22,86.15 97.16,85.09 U$6.3
  Bottom 0.406: R24.2 103.58,86.15 104.14,86.15
  Bottom 0.61: CURRENT3.3 104.14,86.15 99.27,86.15 CS3.1
CUR_SENSE_3_AMP
  Top 0.406: U$6.2 U$6.1 91.25,83.76 R8.1
CUR_SENSE_3_FILT
  Top 0.406: R8.2 84.31,78.98 C10.1 79.77,74.93 70.87,74.93 67.94,72.01 U$2.3
CUR_SENSE_4
  Top 0.406: U$15.3 139.06,86.36 140.12,87.42 147.76,87.42 CURRENT4.3
  Bottom 0.406: R25.2 145.83,86.15 146.05,86.15
  Bottom 0.61: CURRENT4.3 146.05,86.15 141.18,86.15 CS4.1
CUR_SENSE_4_AMP
  Top 0.406: U$15.2 U$15.1 133.16,85.03
  Top 0.61: 133.16,85.03 R35.1
CUR_SENSE_4_FILT
  Top 0.406: R35.2 126.22,80.25 C13.1 120.65,80.25 111.77,71.37 U$2.1
GND  (via drill 0.35)
  Top 0.406: 16.2,40.7 U$4.4 | R29.2 30.73,68.33 v31.75,67.31 C3.2 | U$3.4 25.46,63.56 v24.13,62.23 21.59,59.69 R28.2 | C4.2 v36.58,49.66 C5.2 | R27.2 15.16,45.85 VOLTAGE3.2 14.97,40.7 16.2,40.7 | R26.2 16.2,40.7 | C2.2 78.5,12.7 | 78.5,12.7 78.5,12.95 IC1.2 | 78.5,12.7 78.74,12.95 C1.2 | R21.2 v67.31,22.86 | C6.2 36.83,33.27 v36.83,31.75 | C14.2 v125.73,83.82 C13.2 | U$15.4 141.54,83.82 v142.24,83.82 | C12.2 v83.82,82.55 C10.2 | U$6.4 99.64,82.55 v100.33,82.55 | C9.2 v43.18,82.55 C8.2 | U$7.4 57.73,82.55 v58.42,82.55 | U$2.9 61.59,66.67 62.74,67.82 v64.77,67.82 66.8,67.82 67.94,66.67 U$2.14 | C11.2 v36.83,86.36 C7.2 | v30.48,81.28 29.84,81.92 U$5.4 | MCP3204SOIC.7 41.27,48.9 43.18,50.8 v43.18,52.07 45.09,53.98 MCP3204SOIC.12 | v60.96,50.8 63.5,53.34 v67.31,53.34 | v55.88,48.26 v52.07,44.45
  Bottom 0.406: VOLTAGE4.2 7.62,26.88 7.62,17.78 10.16,15.24 U$1.GND | 48.26,31.75 48.26,36.19
  pour Bottom: 1.27,118.11 1.27,1.27 93.98,1.27 93.98,48.26 123.19,77.47 168.91,77.47 168.91,118.11
N27
  Top 0.406: R26.1 18.03,31.79 | 18.03,31.79 VOLTAGE4.1 | R33.2 25.05,31.79 18.03,31.79
N$1  (via drill 0.35)
  Top 0.406: v48.26,53.34 47.62,52.7 MCP3204SOIC.11
  Bottom 0.406: U$14.13 50.38,53.34 v48.26,53.34
N$2  (via drill 0.35)
  Top 0.406: v48.26,52.07 47.62,51.44 MCP3204SOIC.10
  Bottom 0.406: U$14.12 48.92,52.73 v48.26,52.07
N$3
  Top 0.406: Q2.1 116.84,42.85 R9.2
N$4
  Top 0.406: Q1.1 116.84,60.63 R12.2
N$5
  Top 0.406: U$8.2 125.63,59.69 Q1.3
  Bottom 0.406: FLYBCK1.A 129.54,64.87 125.98,61.32 U$8.2
N$6
  Top 0.406: U$9.2 125.63,41.91 Q2.3
  Bottom 0.406: FLYBCK2.A 129.54,47.09 125.98,43.54 U$9.2
N$7
  Top 0.406: Q3.1 116.84,25.07 R10.2
N$8
  Top 0.406: U$10.2 125.63,24.13 Q3.3
  Bottom 0.406: D3.A 129.54,29.31 125.98,25.76 U$10.2
N$9
  Top 0.406: Q4.1 116.84,7.29 R13.2
N$10
  Top 0.406: U$11.2 125.63,6.35 Q4.3
  Bottom 0.406: D4.A 125.98,8.24 U$11.2
N$11
  Top 0.61: LED2.C 147.54,52.05 R17.1
N$12
  Top 0.61: LED1.C 147.54,69.83 R16.1
N$13
  Top 0.61: LED3.C 147.54,34.27 R18.1
N$14
  Top 0.61: R19.1 147.54,16.48 LED4.C
N$15
  Top 0.406: LED5.C R20.1
N$16
  Top 0.61: LED6.C R21.1
N$17  (via drill 0.35)
  Top 0.406: U$2.13 66.67,64.14 v66.04,63.5
  Bottom 0.406: U$12.13 64.88,57.6 64.88,58.23 66.04,59.39 v66.04,63.5
N$18  (via drill 0.35)
  Top 0.406: U$2.12 65.41,64.14 v64.77,63.5
  Bottom 0.406: U$12.12 64.16,59.68 64.77,60.3 v64.77,63.5
N$19  (via drill 0.35)
  Top 0.406: U$2.11 64.14,64.14 v63.5,63.5
  Bottom 0.406: U$12.11 63.51,59.17 63.5,59.18 v63.5,63.5
N$20  (via drill 0.35)
  Top 0.406: U$2.10 62.87,64.14 v62.23,63.5
  Bottom 0.406: U$12.10 62.86,60.32 62.23,60.95 v62.23,63.5
N$22
  Top 0.406: VOLTAGE1.1 25.4,66.04 | 25.4,66.04 R30.2 | R29.1 25.64,66.28 25.4,66.04
N$23
  Top 0.406: R28.1 17.99,57.97 VOLTAGE2.1 R31.2
N$24
  Top 0.406: VOLTAGE3.1 18.12,43.31 R32.2 R27.1
N$25  (via drill 0.35)
  Top 0.406: v48.26,50.8 47.62,50.16 MCP3204SOIC.9
  Bottom 0.406: U$14.11 49.54,52.08 v48.26,50.8
N$26  (via drill 0.35)
  Top 0.406: v49.28,49.91 48.26,48.9 MCP3204SOIC.8
  Bottom 0.406: U$14.10 50.35,51.36 49.73,51.36 49.29,50.93 49.28,50.93 v49.28,49.91
SPI_CLK  (via drill 0.35)
  Top 0.406: v59.69,36.83 v54.61,31.75
  Bottom 0.406: U$12.2 64.77,52.03 64.77,52.83 64.26,53.34 60.96,53.34 59.69,52.07 | 59.69,52.07 v59.69,36.83 | v54.61,31.75 U$1.D13 | U$14.2 58.38,53.38 59.69,52.07
SPI_CS
  Bottom 0.406: U$1.D10(TX2) 38.1,9.14 62.86,33.9 U$12.5
SPI_CS2
  Bottom 0.406: U$14.5 56.03,51.36 56.66,51.36 57.15,50.86 57.15,31.75 35.56,10.16 U$1.D9(RX2)
SPI_MISO  (via drill 0.35)
  Top 0.406: v58.42,34.29 64.01,28.7 v64.14,28.7
  Bottom 0.406: U$1.D12 43.18,7.62 64.16,28.6 64.16,28.68 | U$12.3 64.16,28.68 | U$14.3 56.03,52.66 56.66,52.66 58.42,50.89 v58.42,34.29 | v64.14,28.7 64.16,28.68
SPI_MOSI  (via drill 0.35)
  Top 0.406: v55.88,31.75 58.42,29.21 v60.96,29.21
  Bottom 0.406: U$1.D11 40.64,8.89 v60.96,29.21 63.51,31.76 U$12.4 | v55.88,31.75 54.61,33.02 54.61,51.44 54.69,51.44 55.33,52.08 U$14.4
SWITCH_1  (via drill 0.38)
  Top 0.406: R12.1 83.82,65.8 66.28,48.26 58.8,48.26 v38.35,27.81
  Bottom 0.406: U$1.A1 38.1,27.56 v38.35,27.81
SWITCH_2  (via drill 0.38)
  Top 0.406: R9.1 58.68,46.74 38.35,26.42 v35.81,26.42
  Bottom 0.406: v35.81,26.42 35.56,26.16 U$1.A2
SWITCH_3  (via drill 0.38)
  Top 0.406: v34.04,25.65 39.88,25.65 41.91,27.69 113.02,27.69 114.3,28.96 R10.1
  Bottom 0.406: v34.04,25.65 33.02,24.64 U$1.A3
SWITCH_4  (via drill 0.35)
  Top 0.406: R13.1 116.59,12.7 115.57,12.7 110.49,7.62 43.18,7.62 v35.56,15.24
  Bottom 0.406: U$1.A4 v35.56,15.24
VOLT_SENSE_1
  Top 0.406: R30.1 28.57,65.16 U$3.3
VOLT_SENSE_1_AMP
  Top 0.406: U$3.2 U$3.1 34.48,63.56 R1.1
VOLT_SENSE_1_FILT
  Top 0.406: C3.1 R1.2 39.37,60.72 39.37,57.15 40.01,56.52 MCP3204SOIC.1
VOLT_SENSE_2
  Top 0.406: R31.1 27.31,58.35 U$3.5
VOLT_SENSE_2_AMP
  Top 0.406: U$3.6 U$3.7 29.84,60.33 30.48,60.96 32,60.96 R2.1
VOLT_SENSE_2_FILT
  Top 0.406: R2.2 C4.1 37.33,55.24 MCP3204SOIC.2
VOLT_SENSE_3
  Top 0.406: R32.1 28.58,40.71 U$4.3
VOLT_SENSE_3_AMP
  Top 0.406: U$4.2 U$4.1 34.48,40.7 R3.1
VOLT_SENSE_3_FILT
  Top 0.406: R3.2 C5.1 38.1,46.22 38.1,52.07 40.01,53.98 MCP3204SOIC.3
VOLT_SENSE_4
  Top 0.406: R33.1 27.31,35.49 U$4.5
VOLT_SENSE_4_AMP
  Top 0.406: U$4.6 U$4.7 29.84,37.47 30.48,38.1 R4.1
VOLT_SENSE_4_FILT
  Top 0.406: R4.2 36.58,38.09 | 36.58,38.09 36.57,35.58 C6.1 | MCP3204SOIC.4 40.01,52.7 38.86,51.56 38.86,40.13 36.82,38.09 36.58,38.09

### Text on the board
tDocu: CURRENT SENSOR CH1 | CURRENT SENSOR CH2 | CURRENT SENSOR CH3 | CURRENT SENSOR CH4 | ↑Current | ↑Current | ↑Current | ↑Current | Install either current sensor or connector, not both (4x) | CONTACTOR CH1 | VOLTAGE SENSE CH1 | VOLTAGE SENSE CH2 | CONTACTOR CH2 | VOLTAGE SENSE CH3 | VOLTAGE SENSE CH4 | CONTACTOR CH3 | 5V | MAIN / POWER | CONTACTOR / POWER | CONTACTOR CH4 | Battery Discharge Monitoring Board 2020 rev3: Dean Plaskon